# EAGLE design Lamp Logic Board_2 (EAGLE 9.4.2)
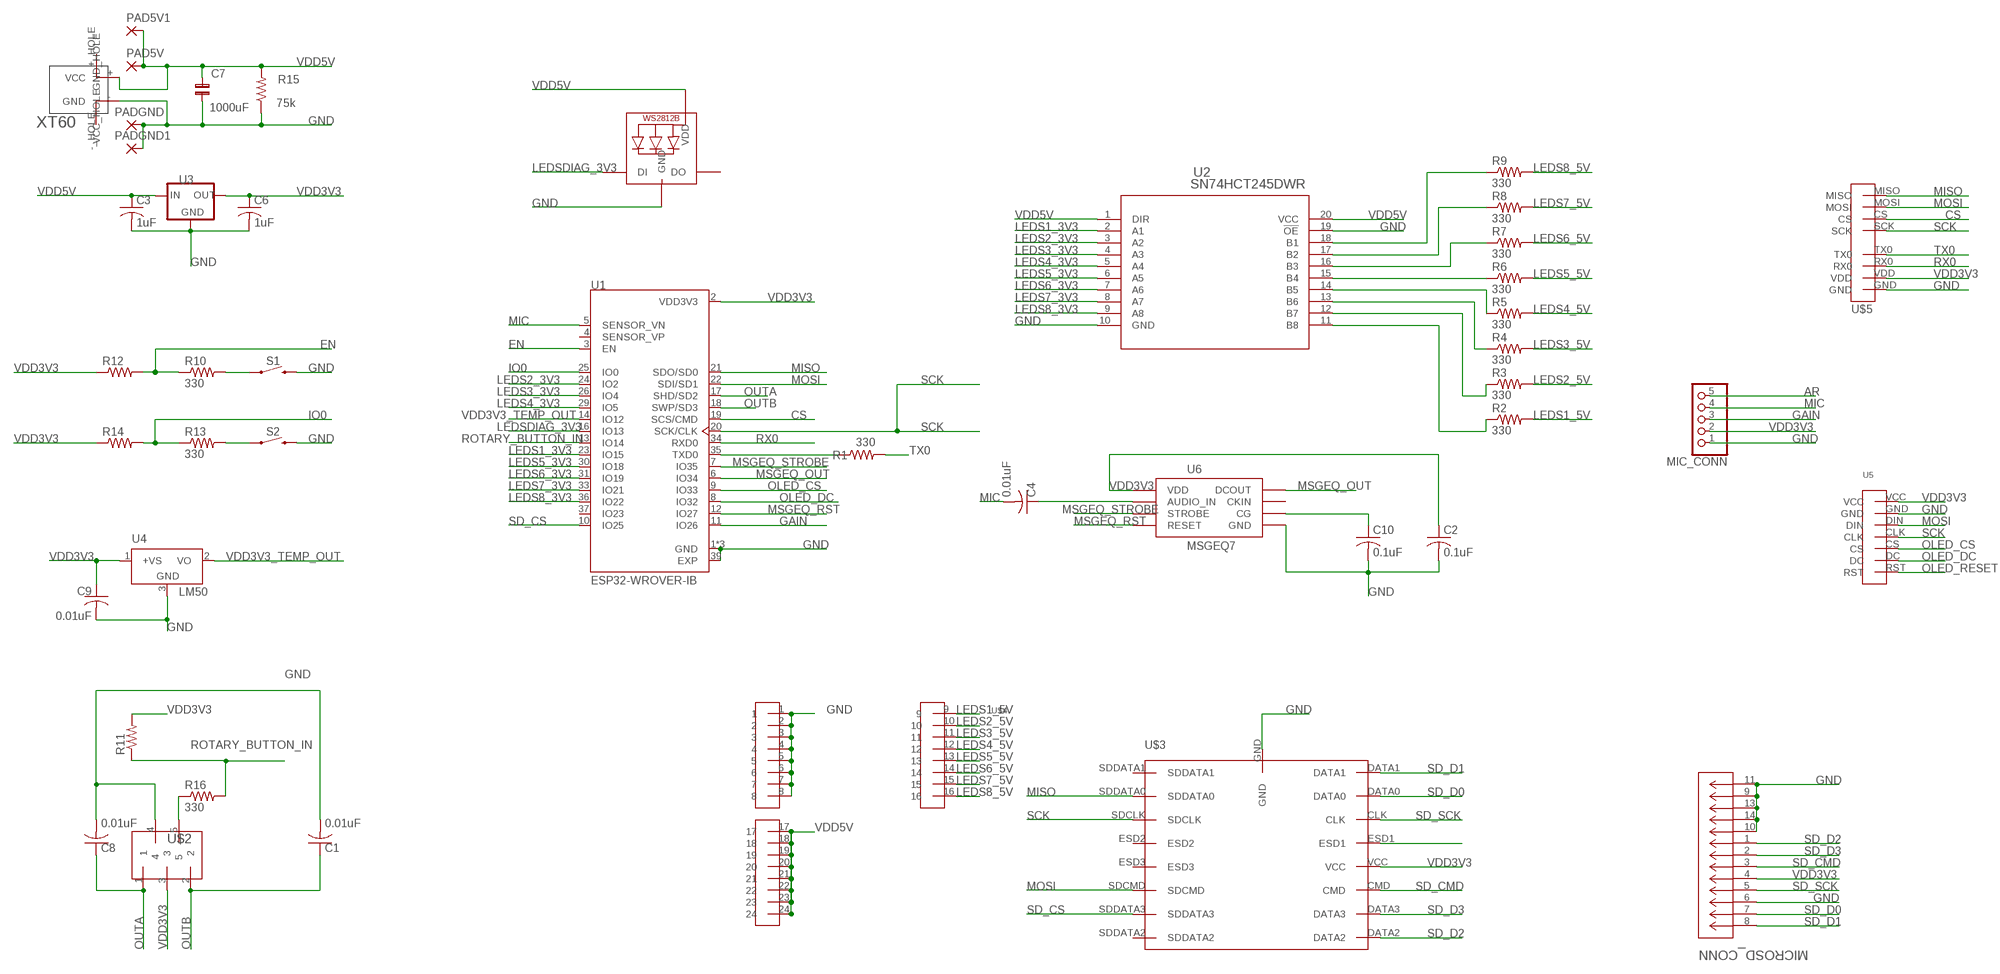
[diagram p0: schematic, sheet 1]

## Parts
C1  0.01uF  C-USC0402  [C0402]
C2  0.1uF  C-USC0805  [C0805]
C3  1uF  C-USC0402  [C0402]
C4  0.01uF  C-USC0402  [C0402]
C6  1uF  C-USC0402  [C0402]
C7  1000uF  C-BP-2,0X5  [ENP2,0-5]
C8  0.01uF  C-USC0402  [C0402]
C9  0.01uF  C-USC0402  [C0402]
C10  0.1uF  C-USC0805  [C0805]
LED1  WS2812B5050  [WS2812B]
MIC_CONN  PINHD-1X5  [1X05]
MICROSD_CONN  LLC  [CON00218_8]
PAD5V  SMD5  [SMD2,54-5,08]
PAD5V1  SMD5  [SMD2,54-5,08]
PADGND  SMD5  [SMD2,54-5,08]
PADGND1  SMD5  [SMD2,54-5,08]
R1  330  R-US_R1206  [R1206]
R2  330  R-US_R1206  [R1206]
R3  330  R-US_R1206  [R1206]
R4  330  R-US_R1206  [R1206]
R5  330  R-US_R1206  [R1206]
R6  330  R-US_R1206  [R1206]
R7  330  R-US_R1206  [R1206]
R8  330  R-US_R1206  [R1206]
R9  330  R-US_R1206  [R1206]
R10  330  R-US_R1206  [R1206]
R11  R-US_R0603  [R0603]
R12  R-US_R0603  [R0603]
R13  330  R-US_R1206  [R1206]
R14  R-US_R0603  [R0603]
R15  75k  R-US_0309/12  [0309/12]
R16  330  R-US_R1206  [R1206]
S1  MOMENTARY-SWITCH-SPST-SMD-6.0X3.5MM  [TACTILE_SWITCH_SMD_6.0X3.5MM]
S2  MOMENTARY-SWITCH-SPST-SMD-6.0X3.5MM  [TACTILE_SWITCH_SMD_6.0X3.5MM]
U1  ESP32-WROVER-IB  ESP32-WROVER-I  [XCVR_ESP32-WROVER-I]
U2  SN74HCT245DWR  [DW20]
U3  LM1117MP-1.8  [SOT223]
U4  LM50  [SOT23]
U5  SPIOLED_STANDOFF  [SPIOLED_STADOFF]
U6  MSGEQ7DIL  [DIL-08]
U$1  XT60  [XT60]
U$2  EN11-HSM1AF15  [EN11-HSM]
U$3  CM1624-08DE  [CM1624-08DE]
U$4  3X8PINHEAD  [3X8PINHEAD]
U$5  2X4PINHEAD  [2X4PINHEAD]

## Nets
AR: MIC_CONN.5
CS: U1.19(SCS/CMD) U$5.CS
EN: R10.1 R12.2 U1.3(EN)
GAIN: MIC_CONN.3 U1.11(IO26)
GND: C1.2 C2.2 C3.2 C6.2 C7.1 C8.2 C9.2 C10.2 LED1.3-GND(GND) MIC_CONN.1 MICROSD_CONN.6 MICROSD_CONN.9 MICROSD_CONN.10 MICROSD_CONN.11 MICROSD_CONN.13 MICROSD_CONN.14 PADGND1.1(P) PADGND.1(P) R15.1 S1.2 S2.2 U1.1(GND) U1.15(GND) U1.38(GND) U1.39(EXP) U2.10(GND) U2.19(!OE) U3.1(GND) U4.3(GND) U5.GND U6.2(GND) U$1.-(GND) U$2.4 U$3.GND U$4.1 U$4.2 U$4.3 U$4.4 U$4.5 U$4.6 U$4.7 U$4.8 U$5.GND
IO0: R13.1 R14.2 U1.25(IO0)
LEDS1_3V3: U1.23(IO15) U2.2(A1)
LEDS1_5V: R2.2 U$4.9
LEDS2_3V3: U1.24(IO2) U2.3(A2)
LEDS2_5V: R3.2 U$4.10
LEDS3_3V3: U1.26(IO4) U2.4(A3)
LEDS3_5V: R4.2 U$4.11
LEDS4_3V3: U1.29(IO5) U2.5(A4)
LEDS4_5V: R5.2 U$4.12
LEDS5_3V3: U1.30(IO18) U2.6(A5)
LEDS5_5V: R6.2 U$4.13
LEDS6_3V3: U1.31(IO19) U2.7(A6)
LEDS6_5V: R7.2 U$4.14
LEDS7_3V3: U1.33(IO21) U2.8(A7)
LEDS7_5V: R8.2 U$4.15
LEDS8_3V3: U1.36(IO22) U2.9(A8)
LEDS8_5V: R9.2 U$4.16
LEDSDIAG_3V3: LED1.4-DIN(DI) U1.16(IO13)
MIC: C4.2 MIC_CONN.4 U1.5(SENSOR_VN)
MISO: U1.21(SDO/SD0) U$3.SDDATA0 U$5.MISO
MOSI: U1.22(SDI/SD1) U5.DIN U$3.SDCMD U$5.MOSI
MSGEQ_OUT: U1.6(IO34) U6.3(DCOUT)
MSGEQ_RST: U1.12(IO27) U6.7(RESET)
MSGEQ_STROBE: U1.7(IO35) U6.4(STROBE)
N$1: R9.1 U2.18(B1)
N$2: R1.1 U1.35(TXD0)
N$3: C4.1 U6.5(AUDIO_IN)
N$4: C10.1 U6.6(CG)
N$5: R16.1 U$2.5
N$6: R8.1 U2.17(B2)
N$7: R13.2 S2.1
N$8: U$3.ESD1
N$9: R10.2 S1.1
N$10: R7.1 U2.16(B3)
N$11: R6.1 U2.15(B4)
N$12: R5.1 U2.14(B5)
N$13: R4.1 U2.13(B6)
N$14: R3.1 U2.12(B7)
N$15: R2.1 U2.11(B8)
OLED_CS: U1.9(IO33) U5.CS
OLED_DC: U1.8(IO32) U5.DC
OLED_RESET: U5.RST
OUTA: C8.1 U1.17(SHD/SD2) U$2.1
OUTB: C1.1 U1.18(SWP/SD3) U$2.2
ROTARY_BUTTON_IN: R11.1 R16.2 U1.13(IO14)
RX0: U1.34(RXD0) U$5.RX0
SCK: U1.20(SCK/CLK) U5.CLK U$3.SDCLK U$5.SCK
SD_CMD: MICROSD_CONN.3 U$3.CMD
SD_CS: U1.10(IO25) U$3.SDDATA3
SD_D0: MICROSD_CONN.7 U$3.DATA0
SD_D1: MICROSD_CONN.8 U$3.DATA1
SD_D2: MICROSD_CONN.1 U$3.DATA2
SD_D3: MICROSD_CONN.2 U$3.DATA3
SD_SCK: MICROSD_CONN.5 U$3.CLK
TX0: R1.2 U$5.TX0
VDD3V3: C2.1 C6.1 C9.1 MIC_CONN.2 MICROSD_CONN.4 R11.2 R12.1 R14.1 U1.2(VDD3V3) U3.2(OUT) U3.4(OUT) U4.1(+VS) U5.VCC U6.1(VDD) U$2.3 U$3.VCC U$5.VDD
VDD3V3_TEMP_OUT: U1.14(IO12) U4.2(VO)
VDD5V: C3.1 C7.2 LED1.1-VDD(VDD) PAD5V1.1(P) PAD5V.1(P) R15.2 U2.1(DIR) U2.20(VCC) U3.3(IN) U$1.+(VCC) U$4.17 U$4.18 U$4.19 U$4.20 U$4.21 U$4.22 U$4.23 U$4.24
Unconnected: LED1.2-DOUT(DO) U1.4(SENSOR_VP) U1.37(IO23) U6.8(CKIN) U$1.+_HOLE(VCC_HOLE) U$1.-_HOLE(GND_HOLE) U$3.ESD2 U$3.ESD3 U$3.SDDATA1 U$3.SDDATA2

## Library data of the parts
C1-C4 C6 C8-C10 = resistor:C-US: CAPACITOR, American symbol
C7 = cap-pan40:C-BP: BIPOLAR ELECTROLYTIC
LED1 = WS2812B:WS2812B; AVAILABILITY: Unavailable; DESCRIPTION: Intelligent Control Led Integrated Light Source Pack Of 10; MF: Seeed Technology; MP: WS2812B; PACKAGE: None; PRICE: None
MIC_CONN = pinhead:PINHD-1X5: PIN HEADER
MICROSD_CONN = 5027740891:LLC; MANUFACTURER_PART_NUMBER: LLC; VENDOR: Molex Connector Corporation
PAD5V PAD5V1 PADGND PADGND1 = wirepad:SMD5: SMD PAD
R1-R16 = resistor:R-US_: RESISTOR, American symbol
S1 S2 = SparkFun-Switches:MOMENTARY-SWITCH-SPST: Momentary Switch (Pushbutton) - SPST Normally-open (NO) SPST momentary switches (buttons, pushbuttons). Variants PTH-12MM - 12mm square, through-hole Momentary Pushbutton Switch - 12mm Square <https://www.sparkfun.com/products/9190> (COM-09190) PTH-6.0MM, PTH-6.0MM-KIT - 6.0mm square, through-hole Mini Pushbutton Switch <https://www.sparkfun.com/products/97> (COM-00097) KIT package intended for soldering kit's - only one side of pads' copper is exposed. PTH-RIGHT-ANGLE-KIT - Right-angle, through-hole Right Angle Tactile Button <https://www.sparkfun.com/products/10791> - Used on SparkFun BigTime Watch Kit <https://www.sparkfun.com/products/11734> SMD-12MM - 12mm square, surface-mount Tactile Button - SMD (12mm) <https://www.sparkfun.com/products/12993> (COM-12993) Used on SparkFun PicoBoard <https://www.sparkfun.com/products/11888> SMD-4.5MM - 4.5mm Square Trackball Switch Used on SparkFun Blackberry Trackballer Breakout <https://www.sparkfun.com/products/13169> SMD-4.6MMX2.8MM - 4.60mm x 2.80mm, surface mount Used on SparkFun SAMD21 Mini Breakout <https://www.sparkfun.com/products/13664> SMD-5.2MM, SMD-5.2-REDUNDANT - 5.2mm square, surface-mount Mini Pushbutton Switch - SMD <https://www.sparkfun.com/products/8720> (COM-08720) Used on Arduino Pro Mini <https://www.sparkfun.com/products/11114> REDUNDANT package connects both switch circuits together SMD-6.0X3.5MM - 6.0 x 3.5mm, surface mount Momentary Reset Switch SMD <https://www.sparkfun.com/products/8229> (COM-08229) SMD-6.2MM-TALL - 6.2mm square, surface mount Tactile Button - SMD (6mm) <https://www.sparkfun.com/products/12992> Used on SparkFun Digital Sandbox <https://www.sparkfun.com/products/12651> SMD-RIGHT-ANGLE - Right-angle, surface mount Used on SparkFun Block for Intel® Edison - Arduino <https://www.sparkfun.com/products/13036>; PROD_ID: SWCH-00815; SF_SKU: COM-08229
U1 = ESP32-WROVER-I:ESP32-WROVER-I: Module: combo; GPIO, I2C x2, I2S x2, SDIO, SPI x3, UART x3; U.FL; AVAILABILITY: Unavailable; DESCRIPTION: Module: combo; GPIO, I2C x2, I2S x2, SDIO, SPI x3, UART x3; U.FL; MF: Espressif Systems; MP: ESP32-WROVER-I; PACKAGE: Module Espressif Systems; PRICE: None
U2 = SN74HCT245DWR :SN74HCT245DWR; MANUFACTURER_PART_NUMBER: SN74HCT245DWR; VENDOR: Texas Instruments
U3 = lm1117:LM1117?-*: 800mA Low-Dropout Linear Regulator Source: http://ww1.microchip.com/downloads/en/DeviceDoc/39760d.pdf; MF: Texas Instruments; MPN: LM1117MP-1.8; OC_FARNELL: 1469053; OC_NEWARK: 41K3467
U4 = linear:LM50: SOT-23 Single-Supply Centigrade Temperature Sensor Vout = (10mV/°C x Temp °C) +5mmmV Source: http://cache.national.com/ds/LM/LM50.pdf
U5 = SPIOLED-STANDOFF:SPIOLED_STANDOFF
U6 = MSGEQ7:MSGEQ7: 7-band graphic equalizer; DESCRIPTION: Seven Band Graphic Equalizer Display Filter; DIGI-KEY_PART_NUMBER: 1568-1544-ND; DIGI-KEY_PURCHASE_URL: https://www.digikey.com/product-detail/en/sparkfun-electronics/DEV-13116/1568-1544-ND/5764478?utm_source=snapeda&utm_medium=aggregator&utm_campaign=symbol; MF: SparkFun Electronics; MP: MSGEQ7; PACKAGE: SOIC-8 Mixed Signal Integration
U$1 = XT60:XT60: XT60
U$2 = untitled:EN11-HSM1AF15
U$3 = CM1624-08DE:CM1624-08DE
U$4 = 3X8PINHEAD:3X8PINHEAD
U$5 = 2X4PINHEAD:2X4PINHEAD

## Board
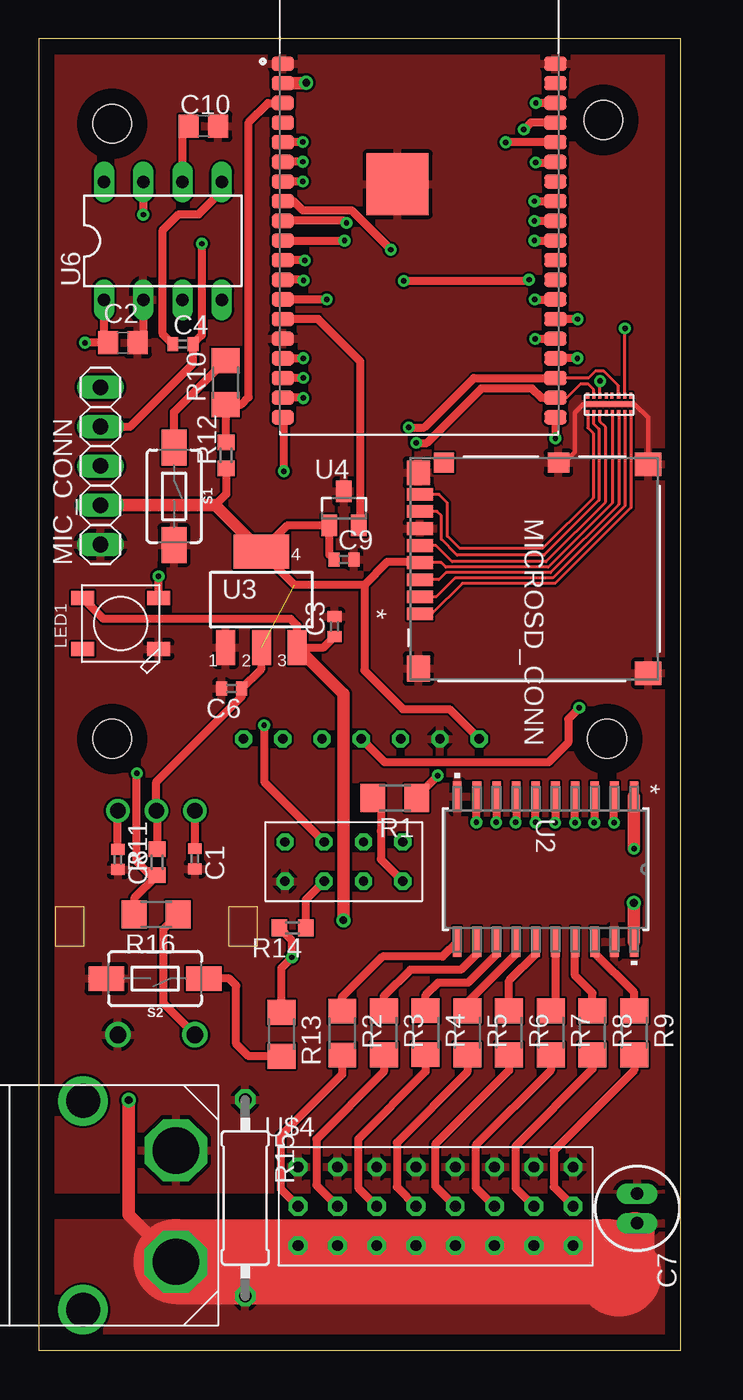
[diagram p1: board, top side]
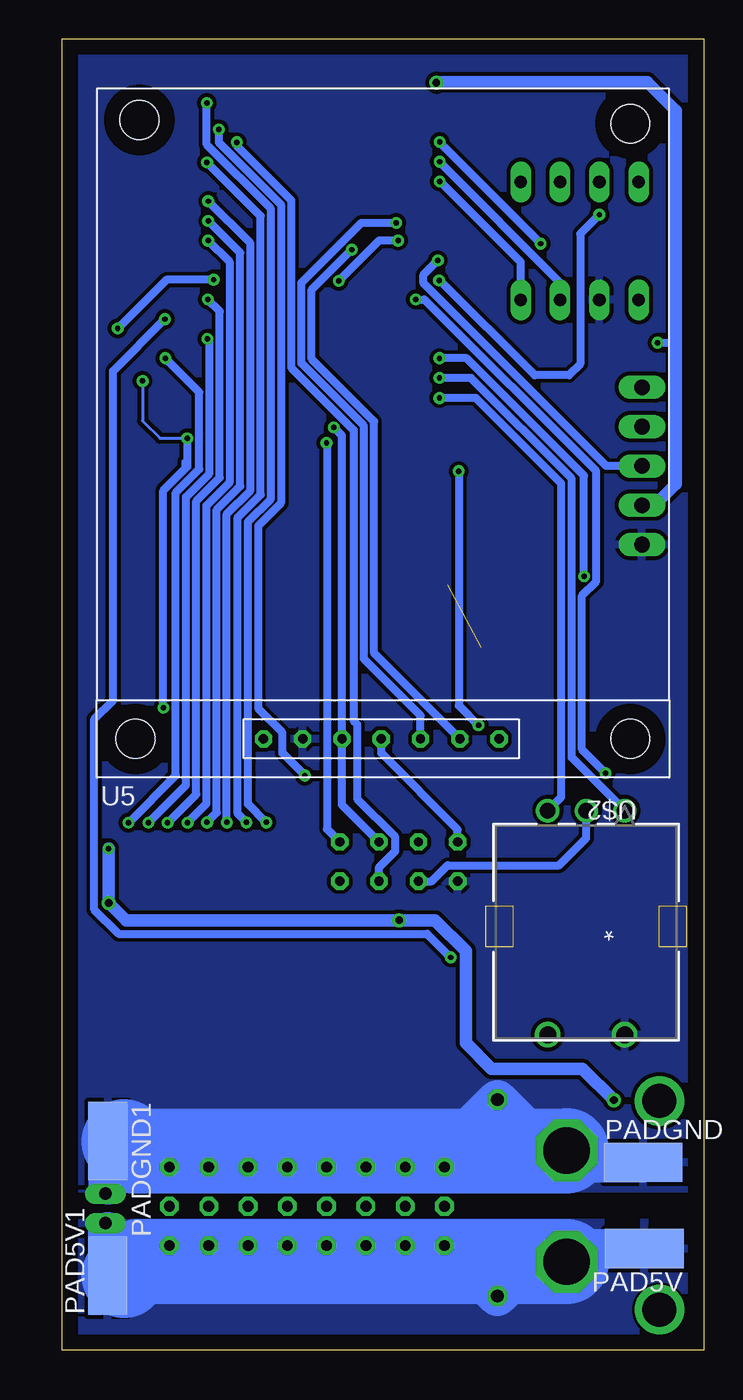
[diagram p2: board, bottom side, seen from below]

Size 41.5 x 84.78 mm. Coordinates in mm from the lower left corner, seen from the top.
Outline: 0,0 41.5,0 41.5,84.78 0,84.78 0,0
Copper layers (1*16): Top 0.035mm / dielectric 1.5mm / Bottom 0.035mm
Design rules "default": minimum track width 6mil, minimum drill 0.35mm, track to track 6mil, track to pad 6mil, pad to pad 6mil, via to via 6mil, smd to smd 6mil, copper to edge 40mil, drill to drill 6mil, minimum pad ring 10mil, minimum via ring 8mil, stop-mask expansion 4mil, vias tented up to drill 0mil, thermal gap 10mil

### Footprints (pad centres in the part's own frame; a part is rotated, then mirrored left to right if it is on the bottom)
C0402 = smd 0.7 x 0.9: 1 -0.65,0; 2 0.65,0
C0805 = smd 1.3 x 1.5: 1 -0.95,0; 2 0.95,0
ENP2,0-5 = drill 0.813 pad 1.27 long: 1 -0.953,0; 2 0.953,0
WS2812B = smd 1.5 x 0.9: 1-VDD 2.45,-1.65; 2-DOUT 2.45,1.65; 3-GND -2.45,1.65; 4-DIN -2.45,-1.65
1X05 = drill 1.016 long: 1 -5.08,0; 2 -2.54,0; 3 0,0; 4 2.54,0; 5 5.08,0
CON00218_8 = smd 0.813 x 1.676: 1 2.899,-7.387; 2 1.799,-7.387; 3 0.699,-7.387; 4 -0.401,-7.387; 5 -1.501,-7.387; 6 -2.601,-7.387; 7 -3.701,-7.387; 8 -4.801,-7.387 | smd 1.499 x 1.702: 9 -6.751,7.374; 10 6.751,7.374 | smd 1.295 x 1.397: 11 -6.859,1.577 | smd 1.295 x 1.295: 12 -6.859,-5.823 | smd 1.6 x 1.499: 13 -6.201,-7.476 | smd 1.702 x 1.499: 14 6.449,-7.476
SMD2,54-5,08 = smd 2.54 x 5.08: 1 0,0
R1206 = smd 1.6 x 1.803: 1 -1.422,0; 2 1.422,0
R0603 = smd 1 x 1.1: 1 -0.85,0; 2 0.85,0
0309/12 = drill 0.813 octagon: 1 -6.35,0; 2 6.35,0
TACTILE_SWITCH_SMD_6.0X3.5MM = smd 2.3 x 1.6: 1 -3.15,0; 2 3.15,0
XCVR_ESP32-WROVER-I = smd 1.45 x 0.93: 1 -8.81,8.26; 2 -8.81,6.99; 3 -8.81,5.72; 4 -8.81,4.45; 5 -8.81,3.18; 6 -8.81,1.91; 7 -8.81,0.64; 8 -8.81,-0.63; 9 -8.81,-1.9; 10 -8.81,-3.17; 11 -8.81,-4.44; 12 -8.81,-5.71; 13 -8.81,-6.98; 14 -8.81,-8.25; 15 -8.81,-9.52; 16 -8.81,-10.79; 17 -8.81,-12.06; 18 -8.81,-13.33; 19 -8.81,-14.6; 20 8.81,-14.6; 21 8.81,-13.33; 22 8.81,-12.06; 23 8.81,-10.79; 24 8.81,-9.52; 25 8.81,-8.25; 26 8.81,-6.98; 27 8.81,-5.71; 28 8.81,-4.44; 29 8.81,-3.17; 30 8.81,-1.9; 31 8.81,-0.63; 32 8.81,0.64; 33 8.81,1.91; 34 8.81,3.18; 35 8.81,4.45; 36 8.81,5.72; 37 8.81,6.99; 38 8.81,8.26 | smd 4 x 4: 39 -1.38,0.47
DW20 = smd 1.981 x 0.559: 1 -4.686,5.715; 2 -4.686,4.445; 3 -4.686,3.175; 4 -4.686,1.905; 5 -4.686,0.635; 6 -4.686,-0.635; 7 -4.686,-1.905; 8 -4.686,-3.175; 9 -4.686,-4.445; 10 -4.686,-5.715; 11 4.686,-5.715; 12 4.686,-4.445; 13 4.686,-3.175; 14 4.686,-1.905; 15 4.686,-0.635; 16 4.686,0.635; 17 4.686,1.905; 18 4.686,3.175; 19 4.686,4.445; 20 4.686,5.715
SOT223 = smd 1.219 x 2.235: 1 -2.311,-3.099; 2 0,-3.099; 3 2.311,-3.099 | smd 3.6 x 2.2: 4 0,3.099
SOT23 = smd 1 x 1.4: 1 -0.95,-1.1; 2 0.95,-1.1; 3 0,1.1
SPIOLED_STADOFF = drill 0.6 octagon: CLK 18.39,2.5; CS 20.93,2.5; DC 23.47,2.5; DIN 15.85,2.5; GND 13.31,2.5; RST 26.01,2.5; VCC 10.77,2.5 | hole 2.5: 2.5,2.5; 34.5,2.5; 34.5,42.25; 2.75,42.5
DIL-08 = drill 0.813 long: 1 -3.81,-3.81; 2 -1.27,-3.81; 3 1.27,-3.81; 4 3.81,-3.81; 5 3.81,3.81; 6 1.27,3.81; 7 -1.27,3.81; 8 -3.81,3.81
XT60 = drill 3 octagon: + 4.1,2.75; - 11.3,2.75 | drill 2.184 pad 2.438: +_HOLE 1,8.75 | drill 2.184 pad 2.413: -_HOLE 14.5,8.75
EN11-HSM = drill 0.991 pad 1.499: 1 -2.489,7.874; 2 2.489,7.874; 3 0,7.874 | drill 1.092 pad 1.6: 4 -2.489,22.352; 5 2.489,22.352
CM1624-08DE = smd 0.2 x 0.4: CLK 1,0; CMD 2.2,0; DATA0 0.6,0; DATA1 0.2,0; DATA2 3,0; DATA3 2.6,0; ESD1 1.4,0; ESD2 1.4,1.125; ESD3 1.775,1.125; SDCLK 1,1.125; SDCMD 2.2,1.125; SDDATA0 0.6,1.125; SDDATA1 0.2,1.125; SDDATA2 3,1.125; SDDATA3 2.6,1.125; VCC 1.8,0 | smd 3 x 0.35: GND 1.575,0.575
3X8PINHEAD = drill 0.7 octagon: 1 0,0; 2 2.54,0; 3 5.08,0; 4 7.62,0; 5 10.16,0; 6 12.7,0; 7 15.24,0; 8 17.78,0; 9 0,-2.54; 10 2.54,-2.54; 11 5.08,-2.54; 12 7.62,-2.54; 13 10.16,-2.54; 14 12.7,-2.54; 15 15.24,-2.54; 16 17.78,-2.54; 17 0,-5.08; 18 2.54,-5.08; 19 5.08,-5.08; 20 7.62,-5.08; 21 10.16,-5.08; 22 12.7,-5.08; 23 15.24,-5.08; 24 17.78,-5.08
2X4PINHEAD = drill 0.6 octagon: CS 3.81,3.81; GND 1.27,1.27; MISO 8.89,3.81; MOSI 6.35,3.81; RX0 6.35,1.27; SCK 1.27,3.81; TX0 8.89,1.27; VDD 3.81,1.27

### Placement (x,y rotation side)
C1  10.1,31.77 270 top
C2  5.45,65.12 0 top
C3  19.12,46.78 90 top
C4  9.32,65.03 0 top
C6  12.47,42.77 180 top
C7  38.7,9.18 270 top
C8  5.12,31.73 270 top
C9  19.73,51.12 0 top
C10  10.65,79.12 0 top
LED1  5.3,46.98 180 top
MIC_CONN  4,57.16 90 top
MICROSD_CONN  32.03,50.52 270 top
PAD5V  3.85,6.58 90 bottom
PAD5V1  38.55,4.83 0 bottom
PADGND  3.92,12.15 270 bottom
PADGND1  38.52,13.53 180 bottom
R1  23.02,35.7 180 top
R2  19.62,20.5 270 top
R3  22.32,20.52 270 top
R4  25.02,20.54 270 top
R5  27.71,20.52 270 top
R6  30.41,20.52 270 top
R7  33.11,20.52 270 top
R8  35.8,20.52 270 top
R9  38.5,20.52 270 top
R10  12.07,62.55 90 top
R11  7.65,31.55 90 top
R12  12.12,57.85 90 top
R13  15.7,20.42 270 top
R14  16.41,27.29 180 top
R15  13.35,9.85 270 top
R16  7.6,28.17 180 top
S1  8.75,55.2 270 top
S2  7.53,24.02 180 top
U1  24.59,74.9 0 top
U2  32.77,31.1 270 top
U3  14.4,48.52 0 top
U4  19.74,54.42 0 top
U5  39.25,37.02 0 bottom
U6  8.03,71.71 0 top
U$1  11.62,1.62 90 top
U$2  7.61,42.75 180 bottom
U$3  35.29,60.58 0 top
U$4  16.77,11.85 0 top
U$5  14.65,29.05 0 top

### Tracks (layer width: path | path; a pad name or v marks a point on that pad's centre or on a via)
CS  (via drill 0.35)
  Top 0.508: 15.78,59.83 U1.19 15.85,60.23 v15.85,56.82 | v14.57,40.4 14.57,36.74 U$5.CS
  Bottom 0.508: v14.57,40.4 15.85,41.67 v15.85,56.82
EN
  Top 0.508: R12.2 12.07,58.75 R10.1 13.1,61.13 13.57,61.6 13.57,79.38 14.82,80.62 U1.3 15.29,80.62
GAIN  (via drill 0.35)
  Top 0.508: v17.2,70.45 15.79,70.45 U1.11
  Bottom 0.508: v17.2,70.45 18.12,69.53 18.12,68.98 6.31,57.16 MIC_CONN.3
GND
  Top 0.305: MICROSD_CONN.9 39.4,60.27 38.52,61.15 U$3.GND 35.2,61.15 34.65,60.6 34.65,58.05 33.79,57.19 33.61,57.19
  Top 0.508: U6.2 6.76,65.48 C2.2
  Bottom 1.27: U$4.8 36.98,11.85 C7.1 38.7,13.35 PADGND1.1
  Bottom 2.54: PADGND.1 3.95,12.12 8.07,12.12 U$1.- 10.07,12.92 R15.1 16.77,12.78 U$4.1 U$4.2 U$4.3 U$4.4 U$4.5 U$4.6 U$4.7 U$4.8 36.85,11.85 PADGND1.1 | PADGND1.1 38.52,10.94 | PADGND1.1 38.52,10.7
  Bottom 5.5: U$1.- 8.91,12.89 36.9,12.89 37.51,13.5
  pour Bottom (isolate 0.254): -4.88,87.63 -4.88,15.95 0.62,10.45 57.05,10.45 57.05,87.59
  pour Top (isolate 0.12): -3.94,10.4 48.75,10.4 48.75,85.85 -12.78,85.85 -12.93,85.7 -12.93,18.25 -9.95,15.28
IO0  (via drill 0.35)
  Top 0.508: R13.1 15.78,21.93 | 33.45,66.7 U1.25 v34.85,66.65 | 15.88,22.02 R13.1 | R14.2 16.38,26.48 v16.38,25.4 15.68,24.7 15.68,21.87 R13.1
  Bottom 0.508: v16.38,25.4 17.9,26.92 37.85,26.92 39.41,28.48 39.41,40.8 38.2,42 38.2,63.3 v34.85,66.65
LEDS1_3V3  (via drill 0.35)
  Top 0.508: 37.2,35.77 U2.2 37.2,35.77 v37.2,34.1 | U1.23 33.38,64.12 v34.83,64.12
  Bottom 0.508: v37.2,34.1 34.15,37.16 34.15,55.43 32.62,56.95 32.62,61.92 v34.83,64.12
LEDS1_5V
  Top 0.508: R2.2 19.62,17.82 15.65,13.85 15.65,10.44 U$4.9
LEDS2_3V3  (via drill 0.35)
  Top 0.305: U2.3 35.95,36.5
  Top 0.508: v35.92,34.1 35.95,34.13 U2.3 | v32.1,65.38 U1.24
  Bottom 0.508: v35.92,34.1 33.49,36.53 33.49,55.15 31.96,56.68 31.96,65.24 v32.1,65.38
LEDS2_5V
  Top 0.508: R3.2 22.32,18.02 17.95,13.65 17.95,10.68 U$4.10
LEDS3_3V3  (via drill 0.35)
  Top 0.508: v34.67,34.1 U2.4 | v32.08,67.93 U1.26
  Bottom 0.508: v34.67,34.1 34.66,34.1 32.83,35.93 32.83,54.88 31.3,56.4 31.3,67.15 v32.08,67.93
LEDS3_5V
  Top 0.508: R4.2 25.02,18.02 20.65,13.65 20.65,10.52 U$4.11
LEDS4_3V3  (via drill 0.35)
  Top 0.508: U2.5 33.41,34.12 v33.38,34.1 | v32.05,71.73 U1.29
  Bottom 0.508: v33.38,34.1 v33.38,34.12 32.17,35.33 32.17,54.61 30.64,56.13 30.64,70.32 v32.05,71.73
LEDS4_5V
  Top 0.508: R5.2 27.71,17.99 23.15,13.42 23.15,10.55 U$4.12
LEDS5_3V3  (via drill 0.35)
  Top 0.508: v32.12,34.12 32.12,35.77 U2.6 | v32.05,73 U1.30
  Bottom 0.508: v32.12,34.12 32.12,34.14 31.51,34.76 31.51,54.33 29.98,55.86 29.98,70.93 v32.05,73
LEDS5_5V
  Top 0.508: R6.2 30.41,18.09 25.62,13.3 25.62,10.62 U$4.13
LEDS6_3V3  (via drill 0.35)
  Top 0.508: U2.7 30.87,34.15 v30.84,34.12 | v32.05,74.28 U1.31
  Bottom 0.508: v30.84,34.12 30.84,54.06 29.32,55.58 29.32,71.55 v32.05,74.28
LEDS6_5V
  Top 0.508: R7.2 33.11,18.11 28.25,13.25 28.25,10.54 U$4.14
LEDS7_3V3  (via drill 0.35)
  Top 0.508: v29.57,34.12 29.6,34.15 U2.8 | v32.12,76.78 33.37,76.78 U1.33
  Bottom 0.508: v29.57,34.12 30.14,34.68 30.14,53.84 28.66,55.31 28.66,73.31 v32.12,76.78
LEDS7_5V
  Top 0.508: R8.2 35.8,18.18 30.82,13.2 30.82,10.5 U$4.15
LEDS8_3V3  (via drill 0.35)
  Top 0.508: v28.3,34.12 28.3,35.76 U2.9 | v32.14,80.62 U1.36
  Bottom 0.508: v28.3,34.12 29.48,35.3 29.48,53.56 28,55.04 28,73.78 32.15,77.93 v32.15,80.62 v32.14,80.62
LEDS8_5V
  Top 0.508: R9.2 38.5,18.1 33.3,12.9 33.3,10.56 U$4.16
LEDSDIAG_3V3  (via drill 0.35)
  Top 0.508: LED1.4-DIN v7.75,50.02 | v17.1,64.12 17.09,64.11 U1.16
  Bottom 0.508: v7.75,50.02 7.75,56.52 15.35,64.12 v17.1,64.12
MIC  (via drill 0.35)
  Top 0.508: 15.8,78.1 U1.5 17.05,78.08 v17.07,78.1 | MIC_CONN.4 5.9,59.7 9.97,63.77 C4.2 10.55,65.6 v10.55,71.53
  Bottom 0.508: v10.55,71.53 17.07,78.05 v17.07,78.1
MISO  (via drill 0.35)
  Top 0.2: U$3.SDDATA0 35.89,62.09 35.52,62.45 35.02,62.45 34.15,61.57 33.74,61.57
  Top 0.254: 33.74,61.57 U1.21
  Top 0.508: v24.4,58.65 25.1,58.65 28.62,62.17 31.9,62.17 32.5,61.57 U1.21
  Bottom 0.508: U$5.MISO 24.38,33.7 24.38,58.62 v24.4,58.65
MOSI  (via drill 0.35)
  Top 0.2: U1.22 33.55,62.84 35.54,62.84 35.98,63.28 36.55,63.28 37.49,62.34 U$3.SDCMD
  Top 0.508: v23.93,59.65 24.94,59.65 28.13,62.84 33.55,62.84
  Bottom 0.508: U$5.MOSI 23.4,35.26 U5.DIN 23.4,59.12 v23.93,59.65
MSGEQ_OUT  (via drill 0.35)
  Top 0.508: U1.6 15.8,76.83 v17.07,76.83
  Bottom 0.508: U6.3 9.3,69.02 17.07,76.8 v17.07,76.83
MSGEQ_RST  (via drill 0.35)
  Top 0.508: U6.7 v6.76,73.4 | v17.12,69.15 17.09,69.19 U1.12
  Bottom 0.508: v6.76,73.4 8,72.16 8,63.75 8.72,63.02 10.94,63.02 17.07,69.15 v17.12,69.15
MSGEQ_STROBE  (via drill 0.35)
  Top 0.508: v17.07,75.55 17.07,75.54 U1.7
  Bottom 0.508: U6.4 11.84,70.34 17.05,75.55 v17.07,75.55
N$1
  Top 0.508: R9.1 38.5,23.12 35.95,25.67 U2.18
N$2  (via drill 0.35)
  Top 0.508: U1.35 31.81,79.35 v31.36,78.9 | v25.8,37.15 24.45,35.8 R1.1
  Bottom 0.508: v31.36,78.9 31.36,78.07 27.34,74.05 27.34,54.76 28.82,53.29 28.82,41.49 27.25,39.92 27.25,38.59 v25.8,37.15
N$3
  Top 0.508: C4.1 8.03,65.68 8.03,72.4 9.05,73.43 10.35,73.43 11.84,74.92 U6.5
N$4
  Top 0.508: U6.6 9.3,78.73 C10.1
N$5
  Top 0.508: R16.1 8.05,27.2 8.05,22.45 U$2.5
N$6
  Top 0.508: R8.1 35.8,23.1 34.68,24.22 U2.17
N$7
  Top 0.508: R13.2 13.57,19 12.78,19.8 12.78,23.57 12.32,24.02 S2.1
N$9
  Top 0.508: S1.1 8.75,60.65 R10.2
N$10
  Top 0.508: U2.16 33.41,22.25 R7.1
N$11
  Top 0.508: R6.1 30.41,23.9 32.14,25.63 U2.15
N$12
  Top 0.508: U2.14 30.87,26.47 30.84,26.5 30.84,25.62 27.71,22.49 R5.1
N$13
  Top 0.508: R4.1 25.02,22.96 25.83,23.77 27.77,23.77 29.6,25.6 U2.13
N$14
  Top 0.508: 28.33,25.78 U2.12 28.33,25.63 27.3,24.6 24.02,24.6 22.32,22.9 R3.1
N$15
  Top 0.508: R2.1 19.62,22.85 22.23,25.46 26.11,25.46 U2.11
OLED_CS  (via drill 0.35)
  Top 0.508: v19.9,72.88 19.77,73 U1.9
  Bottom 0.508: U5.CS 18.32,41.02 21.98,44.68 21.98,59.76 26.02,63.8 26.02,69 22.14,72.88 v19.9,72.88
OLED_DC  (via drill 0.35)
  Top 0.508: v22.77,71.14 20.25,73.66 17.09,73.66 16.48,74.27 U1.8
  Bottom 0.508: U5.DC 21.32,45.06 21.32,60.04 25.36,64.08 25.36,68.55 v22.77,71.14
OUTA  (via drill 0.35)
  Top 0.508: C8.1 5.12,32.3 U$2.1 | 15.79,62.85 U1.17 17.09,62.84 v17.1,62.85
  Bottom 0.508: 5.21,34.88 U$2.1 8.55,38.31 8.55,56.34 15.06,62.85 v17.1,62.85
OUTB  (via drill 0.35)
  Top 0.508: C1.1 10.1,32.47 U$2.2 | v17.1,61.55 17.08,61.57 U1.18
  Bottom 0.508: v17.1,61.55 17.07,61.57 14.77,61.57 9.22,56.03 9.22,35.75 U$2.2
ROTARY_BUTTON_IN  (via drill 0.35)
  Top 0.508: R16.2 6.18,29.23 R11.1 7.25,30.7 6.35,31.6 v6.35,37.3 | v18.62,67.93 v18.62,67.92 U1.13
  Bottom 0.508: v6.35,37.3 7.89,38.84 7.89,48.78 6.96,49.7 6.96,56.81 18.07,67.93 v18.62,67.93
RX0  (via drill 0.35)
  Top 0.508: U1.34 v30.2,78.08
  Bottom 0.508: v30.2,78.08 30.2,77.84 26.68,74.32 26.68,63.53 22.64,59.49 22.64,40.69 22.43,40.48 22.43,35.65 19.95,33.17 19.95,32.27 21,31.23 U$5.RX0
SCK  (via drill 0.35)
  Top 0.2: U$3.SDCLK v36.29,62.65
  Top 0.508: U5.CLK 22.36,38.02 32.98,38.02 34.23,39.27 34.23,40.8 v34.95,41.52 | v33.41,58.95 33.4,58.96 U1.20
  Bottom 0.2: 33.69,57.48 33.69,56.82 | v36.29,62.65 36.29,60.07 35.16,58.95 v33.41,58.95
  Bottom 0.254: 33.69,56.83 33.69,56.82
  Bottom 0.508: v34.95,41.52 34.95,55.56 33.69,56.82 | v33.41,58.95 33.41,57.11 33.69,56.83 | U$5.SCK 15.92,33.66 20.86,38.6 U5.CLK
SD_CMD
  Top 0.2: MICROSD_CONN.3 25.87,49.82 26.32,50.27 33.09,50.27 37.5,54.67 U$3.CMD
SD_CS  (via drill 0.35)
  Top 0.2: U$3.SDDATA3 37.89,66.04 v37.9,66.05
  Top 0.508: U1.10 v19.77,71.73 | v23.6,69.12 31.62,69.12 v31.7,69.2
  Bottom 0.508: v31.7,69.2 34.75,69.2 v37.9,66.05 | v23.6,69.12 21,71.73 v19.77,71.73
SD_D0
  Top 0.2: MICROSD_CONN.7 25.76,54.22 26.02,53.95 26.02,52.42 27.05,51.4 32.67,51.4 36.23,54.95 36.23,59.55 35.89,59.88 U$3.DATA0
  Top 0.254: 24.64,54.05 MICROSD_CONN.7
SD_D1
  Top 0.2: U$3.DATA1 35.49,59.63 35.85,59.27 35.85,55.1 32.58,51.82 27.23,51.82 26.43,52.62 26.43,54.77 25.88,55.32 MICROSD_CONN.8
SD_D2
  Top 0.2: U$3.DATA2 38.28,54.47 33.38,49.56 27.39,49.56 25.44,47.62 MICROSD_CONN.1
SD_D3
  Top 0.2: U$3.DATA3 37.9,60.57 37.9,54.58 33.24,49.92 26.92,49.92 25.7,48.7 24.66,48.7
  Top 0.254: 24.66,48.7 MICROSD_CONN.2
SD_SCK
  Top 0.2: MICROSD_CONN.5 25.68,52.02 26.73,50.98 32.8,50.98 36.66,54.83 36.66,59.67 36.29,60.03 U$3.CLK
TX0
  Top 0.508: R1.2 22.13,35.17 22.13,33.55 22.12,33.55 22.12,31.73 U$5.TX0
VDD3V3  (via drill 0.35, 0.5)  (1 unrouted)
  Top 0.2: U$3.VCC 37.09,54.77 32.95,50.62 26.33,50.62 26.04,50.92 MICROSD_CONN.4
  Top 0.254: 24.69,50.97 MICROSD_CONN.4
  Top 0.508: R11.2 7.65,34.84 U$2.3 7.61,36.75 13.12,42.27 C6.1 14.4,44.05 U3.2 | 21.05,49.47 16.56,49.47 U3.4 16.1,53.32 U4.1 18.79,51.42 C9.1 | R12.1 12.12,55.34 11.4,54.62 | U$5.VDD 17.27,29.12 R14.1 | U6.1 4.22,65.41 C2.1 v3,65.12 | 21.05,49.47 22.55,50.97 24.69,50.97 | 21.05,49.47 21.05,43.95 23.55,41.45 26.55,41.45 U5.VCC
  Top 0.813: U3.4 11.4,54.62 MIC_CONN.2 3.15,54.62 | v17.3,81.93 17.27,81.89 U1.2
  Bottom 0.508: U$2.3 7.61,33.12 9.38,31.35 16.57,31.35 17.61,30.32 U$5.VDD | v3,65.12 1.88,65.12 1.83,65.08
  Bottom 0.813: MIC_CONN.2 3.18,54.62 1.83,55.98 1.83,65.08 1.83,80.13 3.65,81.95 17.27,81.95 v17.3,81.93
VDD3V3_TEMP_OUT
  Top 0.254: 15.8,66.62 U1.14
  Top 0.508: 15.83,66.6 U1.14 18.07,66.65 20.79,63.93 20.79,53.42 U4.2
VDD5V  (via drill 0.35, 0.5)
  Top 0.508: LED1.1-VDD 4.2,47.27 16.29,47.27 16.71,46.85 U3.3 18.42,45.43 C3.1
  Top 0.813: U2.1 v38.49,32.42 | U$1.+ 5.83,8.78 v5.83,16.17 | v38.48,28.92 U2.20 | v19.7,27.8 19.7,42.44 U3.3
  Top 2.54: 37.51,4.93 9.68,4.93 U$1.+ | U$4.17 U$4.18 U$4.19 U$4.20 U$4.21 U$4.22 U$4.23 U$4.24 | 38.55,5.97 38.55,7.65
  Top 5.5: U$1.+ 36.71,5.72 37.51,4.93
  Bottom 0.813: v5.83,16.17 7.85,18.2 13.72,18.2 15.4,19.88 15.4,25.82 17.38,27.8 v19.7,27.8 37.36,27.8 v38.48,28.92 v38.48,32.41 v38.49,32.42
  Bottom 1.27: U$4.24 37.25,6.77 C7.2 38.7,4.97 PAD5V1.1
  Bottom 2.54: PAD5V.1 8.03,6.58 U$1.+ 11.12,5.72 R15.2 16.62,6.77 U$4.17 | PAD5V1.1 38.55,7.65 | U$4.24 37.03,6.77
  Bottom 5.5: U$1.+ 36.61,5.72 37.51,4.83
  pour Bottom (isolate 0.12): -1.29,8.25 45.23,8.25 45.23,-0.98 41.42,-4.78 3.6,-4.78 -1.37,0.2
  pour Top (isolate 0.12): -2.22,8.25 45.38,8.25 48.2,5.43 48.2,-0.15 44.88,-3.48 -2,-3.48